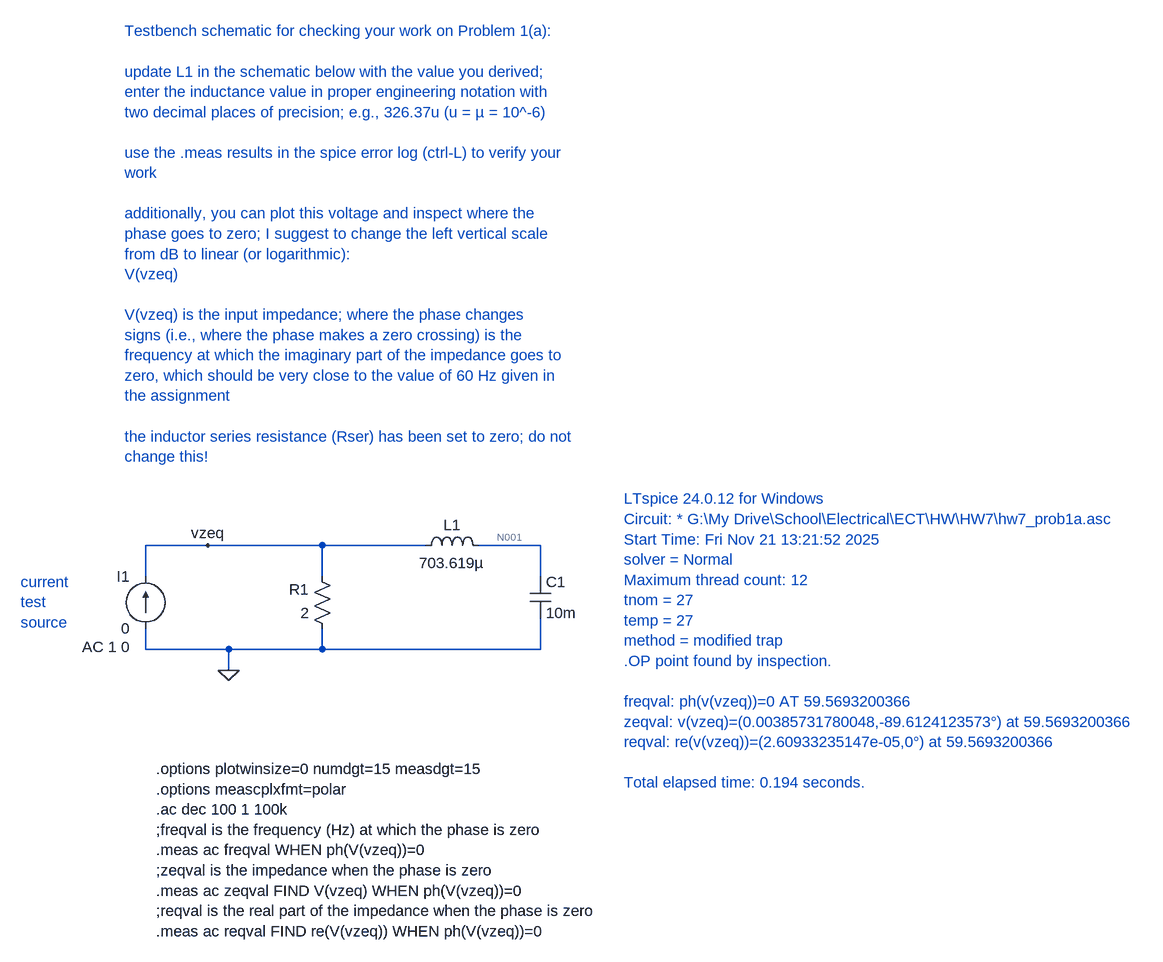
[diagram p0: schematic hw7_prob1a.asc]
hw7_prob1a.asc, the LTspice schematic file:
Version 4
SHEET 1 1036 680
WIRE -480 -160 -576 -160
WIRE -304 -160 -480 -160
WIRE -144 -160 -304 -160
WIRE 32 -160 -64 -160
WIRE -576 -112 -576 -160
WIRE -304 -112 -304 -160
WIRE 32 -112 32 -160
WIRE -576 0 -576 -32
WIRE -448 0 -576 0
WIRE -304 0 -304 -32
WIRE -304 0 -448 0
WIRE 32 0 32 -48
WIRE 32 0 -304 0
WIRE -448 32 -448 0
FLAG -448 32 0
FLAG -480 -160 vzeq
SYMBOL res -288 -16 R180
WINDOW 0 36 76 Left 2
WINDOW 3 36 40 Left 2
SYMATTR InstName R1
SYMATTR Value 2
SYMBOL ind -160 -144 R270
WINDOW 0 32 56 VTop 2
WINDOW 3 5 56 VBottom 2
SYMATTR InstName L1
SYMATTR Value 703.619µ
SYMATTR SpiceLine Rser=0
SYMBOL cap 16 -112 R0
SYMATTR InstName C1
SYMATTR Value 10m
SYMBOL current -576 -32 R180
WINDOW 0 24 80 Left 2
WINDOW 3 24 0 Left 2
WINDOW 123 24 -28 Left 2
SYMATTR InstName I1
SYMATTR Value 0
SYMATTR Value2 AC 1 0
TEXT -768 -104 Left 2 ;current\ntest\nsource
TEXT -560 184 Left 2 !.options plotwinsize=0 numdgt=15 measdgt=15\n.options meascplxfmt=polar\n.ac dec 100 1 100k\n;freqval is the frequency (Hz) at which the phase is zero\n.meas ac freqval WHEN ph(V(vzeq))=0\n;zeqval is the impedance when the phase is zero\n.meas ac zeqval FIND V(vzeq) WHEN ph(V(vzeq))=0\n;reqval is the real part of the impedance when the phase is zero\n.meas ac reqval FIND re(V(vzeq)) WHEN ph(V(vzeq))=0
TEXT -608 -952 Left 2 ;Testbench schematic for checking your work on Problem 1(a):\n \nupdate L1 in the schematic below with the value you derived; \nenter the inductance value in proper engineering notation with \ntwo decimal places of precision; e.g., 326.37u (u = µ = 10^-6)\n \nuse the .meas results in the spice error log (ctrl-L) to verify your \nwork\n \nadditionally, you can plot this voltage and inspect where the \nphase goes to zero; I suggest to change the left vertical scale\nfrom dB to linear (or logarithmic):\nV(vzeq)\n \nV(vzeq) is the input impedance; where the phase changes \nsigns (i.e., where the phase makes a zero crossing) is the \nfrequency at which the imaginary part of the impedance goes to \nzero, which should be very close to the value of 60 Hz given in\nthe assignment\n \nthe inductor series resistance (Rser) has been set to zero; do not\nchange this!
TEXT 160 -232 Left 2 ;LTspice 24.0.12 for Windows\nCircuit: * G:\\My Drive\\School\\Electrical\\ECT\\HW\\HW7\\hw7_prob1a.asc\nStart Time: Fri Nov 21 13:21:52 2025\nsolver = Normal\nMaximum thread count: 12\ntnom = 27\ntemp = 27\nmethod = modified trap\n.OP point found by inspection.\n \nfreqval: ph(v(vzeq))=0 AT 59.5693200366\nzeqval: v(vzeq)=(0.00385731780048,-89.6124123573°) at 59.5693200366\nreqval: re(v(vzeq))=(2.60933235147e-05,0°) at 59.5693200366\n \nTotal elapsed time: 0.194 seconds.

The netlist it stands for:
* hw7_prob1a.asc
R1 0 vzeq 2
L1 vzeq N001 703.619µ Rser=0
C1 N001 0 10m
I1 0 vzeq 0 AC 1 0
* current
* test
* source
.options plotwinsize=0 numdgt=15 measdgt=15
.options meascplxfmt=polar
.ac dec 100 1 100k
;freqval is the frequency (Hz) at which the phase is zero
.meas ac freqval WHEN ph(V(vzeq))=0
;zeqval is the impedance when the phase is zero
.meas ac zeqval FIND V(vzeq) WHEN ph(V(vzeq))=0
;reqval is the real part of the impedance when the phase is zero
.meas ac reqval FIND re(V(vzeq)) WHEN ph(V(vzeq))=0
* Testbench schematic for checking your work on Problem 1(a):
* update L1 in the schematic below with the value you derived;
* enter the inductance value in proper engineering notation with
* two decimal places of precision; e.g., 326.37u (u = µ = 10^-6)
* use the .meas results in the spice error log (ctrl-L) to verify your
* work
* additionally, you can plot this voltage and inspect where the
* phase goes to zero; I suggest to change the left vertical scale
* from dB to linear (or logarithmic):
* V(vzeq)
* V(vzeq) is the input impedance; where the phase changes
* signs (i.e., where the phase makes a zero crossing) is the
* frequency at which the imaginary part of the impedance goes to
* zero, which should be very close to the value of 60 Hz given in
* the assignment
* the inductor series resistance (Rser) has been set to zero; do not
* change this!
* LTspice 24.0.12 for Windows
* Circuit: * G:\My Drive\School\Electrical\ECT\HW\HW7\hw7_prob1a.asc
* Start Time: Fri Nov 21 13:21:52 2025
* solver = Normal
* Maximum thread count: 12
* tnom = 27
* temp = 27
* method = modified trap
* .OP point found by inspection.
* freqval: ph(v(vzeq))=0 AT 59.5693200366
* zeqval: v(vzeq)=(0.00385731780048,-89.6124123573°) at 59.5693200366
* reqval: re(v(vzeq))=(2.60933235147e-05,0°) at 59.5693200366
* Total elapsed time: 0.194 seconds.
.backanno
.end

* Results of the author's LTspice run, read from the files saved beside the schematic
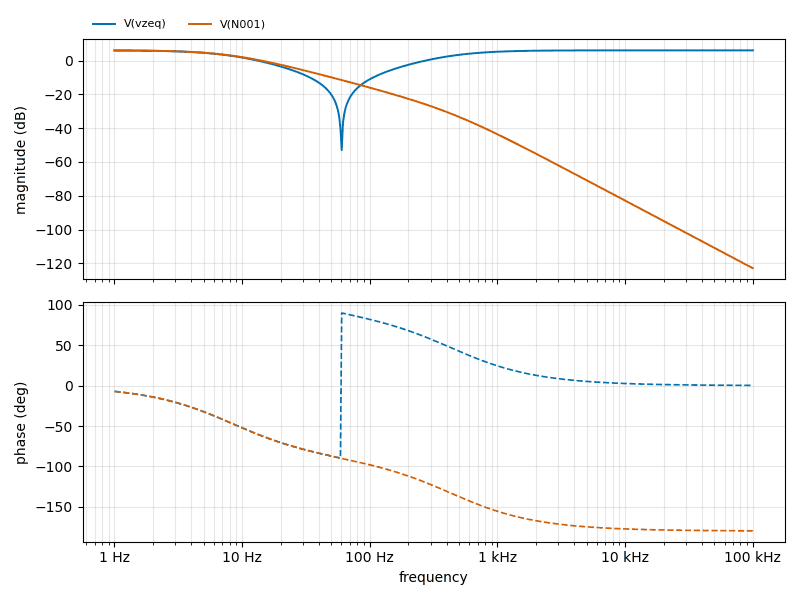
[diagram p1: AC Analysis of hw7_prob1a.asc, plotted from the saved traces]
* AC Analysis, 1 run:
*   V(vzeq): 5.95 dB at 1 Hz, 6.02 dB at 100 kHz, peak 6.02 dB at 100 kHz, 3 dB below the peak at 460.2 Hz
*   V(N001): 5.95 dB at 1 Hz, -122.85 dB at 100 kHz, peak 5.95 dB at 1 Hz, 3 dB below the peak at 8.222 Hz
* From the log:
*   freqval: ph(v(vzeq))=0 AT 59.5693200366
*   zeqval: v(vzeq)=(0.00385731780048,-89.6124123573°) at 59.5693200366
*   reqval: re(v(vzeq))=(2.60933235147e-05,0°) at 59.5693200366